# Altium schematic sheet 1-RF.SchDoc: RF
size A3; Date: 20150330; DrawnBy: mango; DocumentNumber: 1; SheetNumber: 1; SheetTotal: 7; CurrentTime: sdfsdfsd
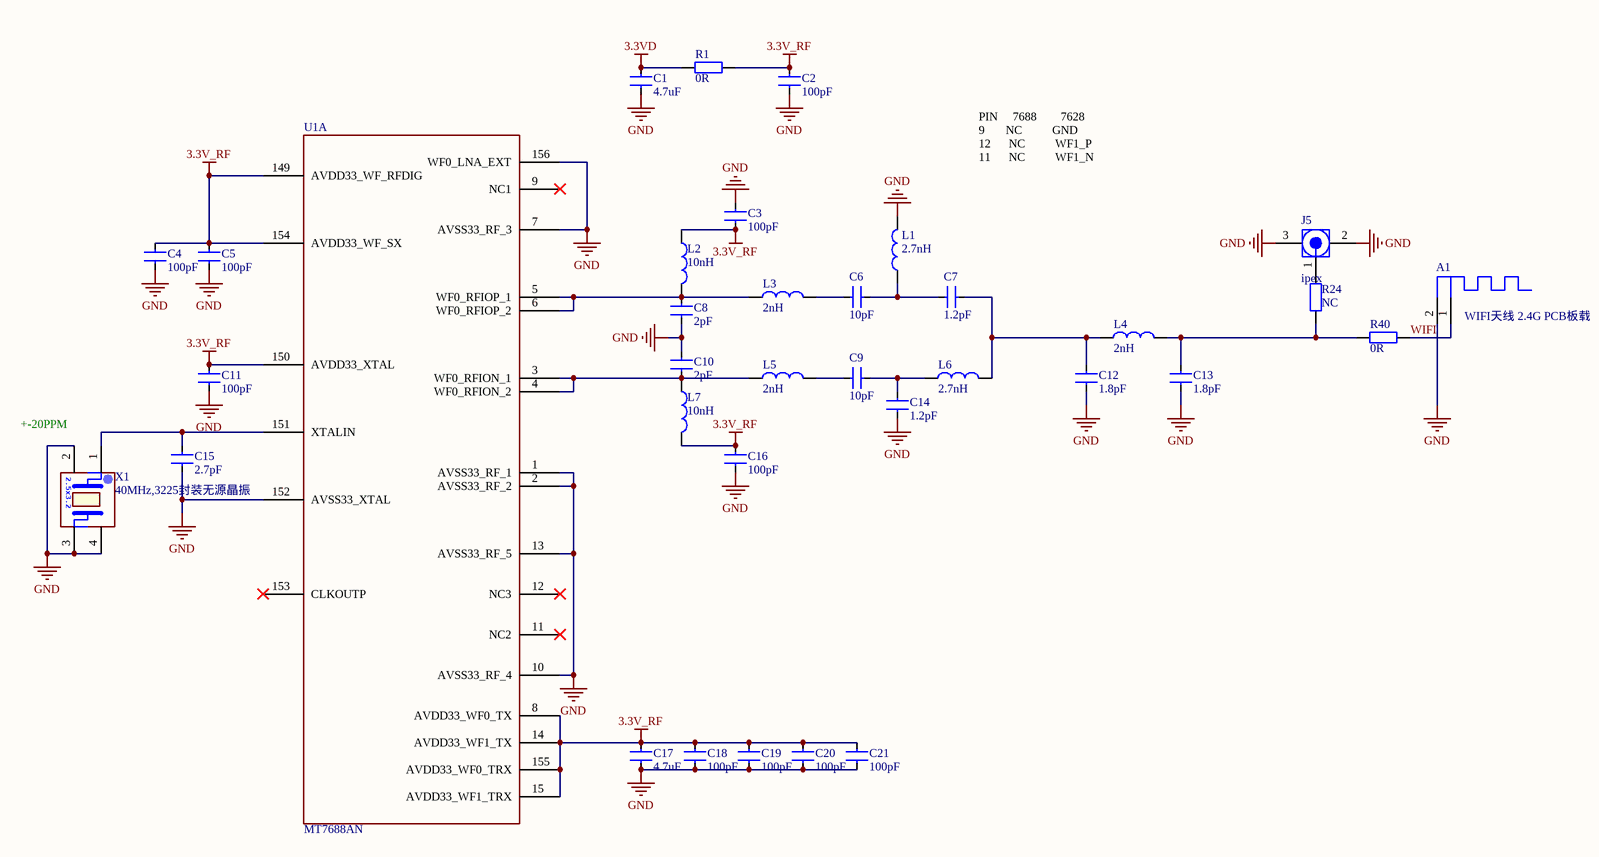
[diagram p0: 1-RF.SchDoc]

## Parts
A1  WIFI天线 2.4G PCB板载  [2.4G - mirror]
C1  4.7uF  [C0402]
C2  100pF  [C0402]
C3  100pF  [C0402]
C4  100pF  [C0402]
C5  100pF  [C0402]
C6  10pF  [C0402]
C7  1.2pF  [C0402]
C8  2pF  [C0402]
C9  10pF  [C0402]
C10  2pF  [C0402]
C11  100pF  [C0402]
C12  1.8pF  [C0402]
C13  1.8pF  [C0402]
C14  1.2pF  [C0402]
C15  2.7pF  [C0402]
C16  100pF  [C0402]
C17  4.7uF  [C0402]
C18  100pF  [C0402]
C19  100pF  [C0402]
C20  100pF  [C0402]
C21  100pF  [C0402]
J5  ipex  [IPEX]
L1  2.7nH  [L0402]
L2  10nH  [L0402]
L3  2nH  [L0402]
L4  2nH  [L0402]
L5  2nH  [L0402]
L6  2.7nH  [L0402]
L7  10nH  [L0402]
R1  0R  [R0402]
R24  NC  [R0402]
R40  0R  [R0402]
U1  MT7688AN  [MT7628AN/DRQFN156/SMD/P0.5/12X12]  (part A of 6)
X1  40MHz,3225封装无源晶振  [XTAL3225]

## Nets
3.3V_RF: C2.1 C3.2 C4.1 C5.1 C11.1 C16.1 C17.1 C18.1 C19.1 C20.1 C21.1 L2.2 L7.1 R1.2 U1.8(AVDD33_WF0_TX) U1.14(AVDD33_WF1_TX) U1.15(AVDD33_WF1_TRX) U1.149(AVDD33_WF_RFDIG) U1.150(AVDD33_XTAL) U1.154(AVDD33_WF_SX) U1.155(AVDD33_WF0_TRX)
3.3VD: C1.1 R1.1
GND: A1.2(G) C1.2 C2.2 C3.1 C4.2 C5.2 C8.2 C10.1 C11.2 C12.2 C13.2 C14.1 C15.1 C16.2 C17.2 C18.2 C19.2 C20.2 C21.2 J5.2(GND) J5.3(GND) L1.1 U1.1(AVSS33_RF_1) U1.2(AVSS33_RF_2) U1.7(AVSS33_RF_3) U1.10(AVSS33_RF_4) U1.13(AVSS33_RF_5) U1.152(AVSS33_XTAL) U1.156(WF0_LNA_EXT) X1.2(NC1) X1.3(X2) X1.4(NC2)
WIFI: A1.1 R40.2
NetC6_1: C6.1 L3.1
NetC6_2: C6.2 C7.2 L1.2
NetC7_1: C7.1 C12.1 L4.2 L6.1
NetC8_1: C8.1 L2.1 L3.2 U1.5(WF0_RFIOP_1) U1.6(WF0_RFIOP_2)
NetC9_1: C9.1 L5.1
NetC9_2: C9.2 C14.2 L6.2
NetC10_2: C10.2 L5.2 L7.2 U1.3(WF0_RFION_1) U1.4(WF0_RFION_2)
NetC13_1: C13.1 L4.1 R24.1 R40.1
NetC15_2: C15.2 U1.151(XTALIN) X1.1(X1)
NetJ5_1: J5.1(Signal) R24.2

Not connected (* = marked no-connect by the designer): U1 9(NC1)* 11(NC2)* 12(NC3)* 153(CLKOUTP)*

## Notes on the sheet
- PIN     7688        7628
  9       NC          GND
  12      NC          WF1_P
  11      NC          WF1_N
- (near X1) +-20PPM
- (in symbol XTAL3225) 2.5x3.2

## Library data of the parts
A1 = ANT2.4G
C1-C5 C11 C15-C21 = CAP: 普通小电容
C6 C9 = CAP: GRM1555C1H100JA01D,500R07N100JV4
C7 C14 = CAP: GRM1555C1H1R2CA01D,500R07N1R2CV4
C8 C10 = CAP: GRM1555C1H2R0CA01D,500R07N2R0CV4
C12 C13 = CAP: GRM1555C1H1R8CA01D
J5 = MCX_IPEX
L1 L6 = L0402: LQG15HS2N7S02,MLG1005S2N7ST
L2 L7 = L0402: LQG15HS10NJ02,MLG1005S10NJT,HI1005-1C10NJMT
L3-L5 = L0402: LQG15HS2N0S02
R1 R24 R40 = RES: 普通电阻
X1 = XTAL3225: 贴片晶振